# Altium schematic sheet 运输机器人3-1.SchDoc
size A2
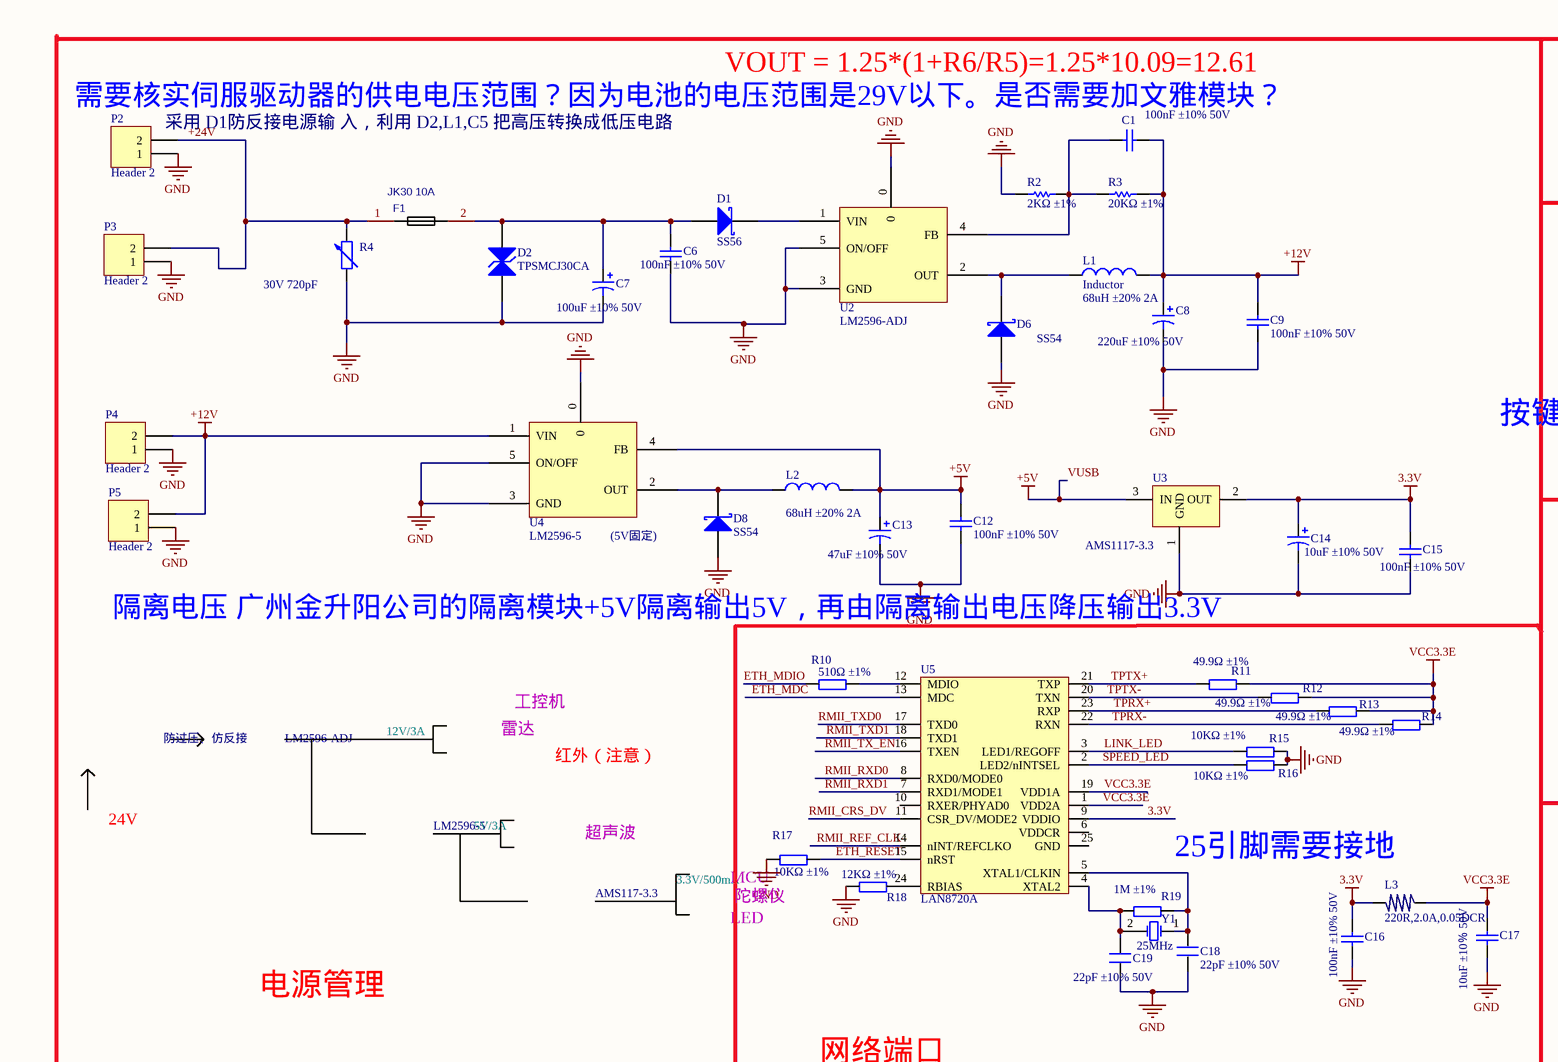
[diagram p0: 运输机器人3-1.SchDoc, top left]
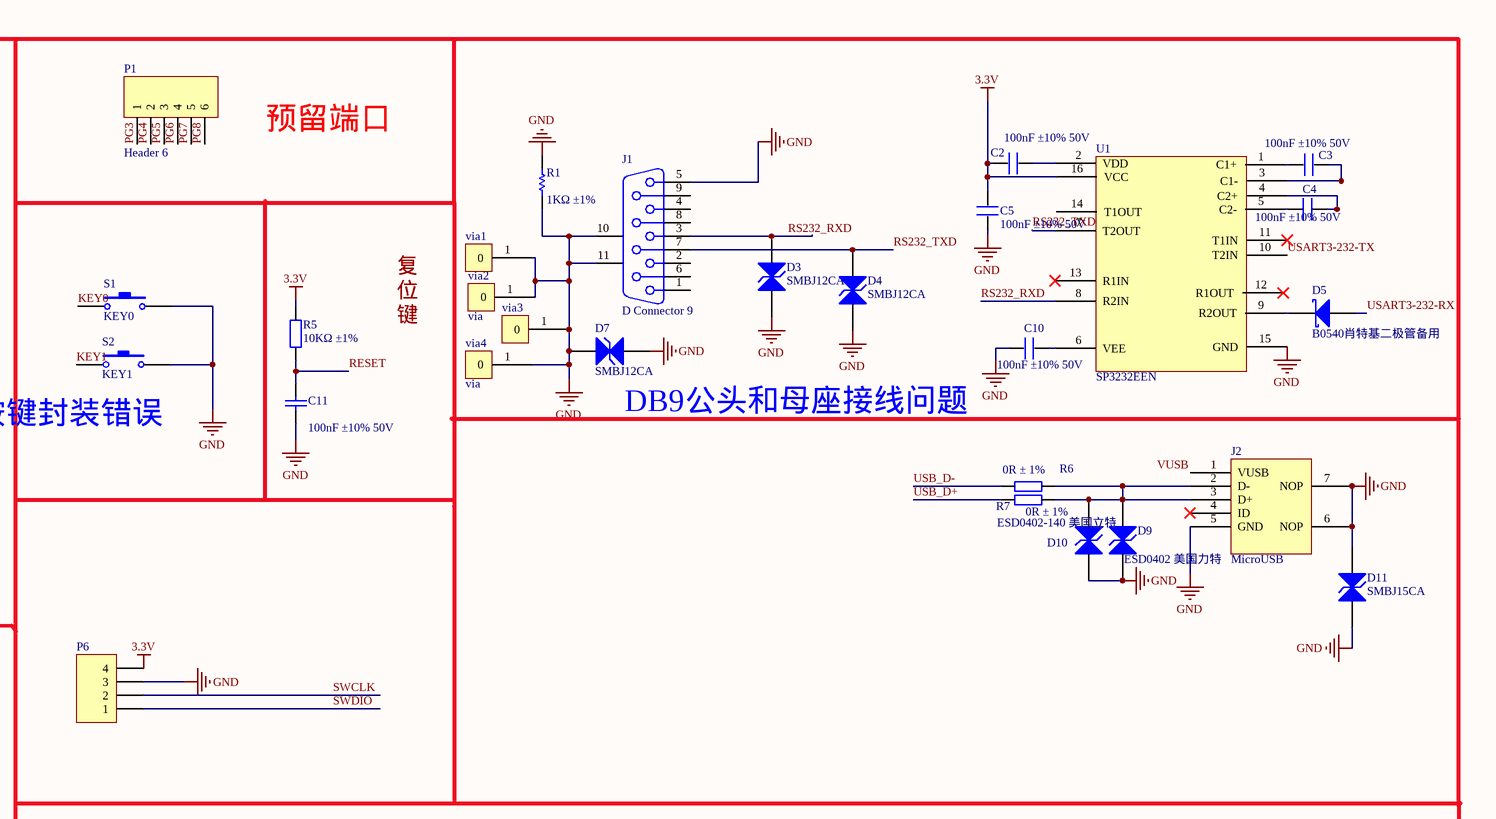
[diagram p1: 运输机器人3-1.SchDoc, top right]
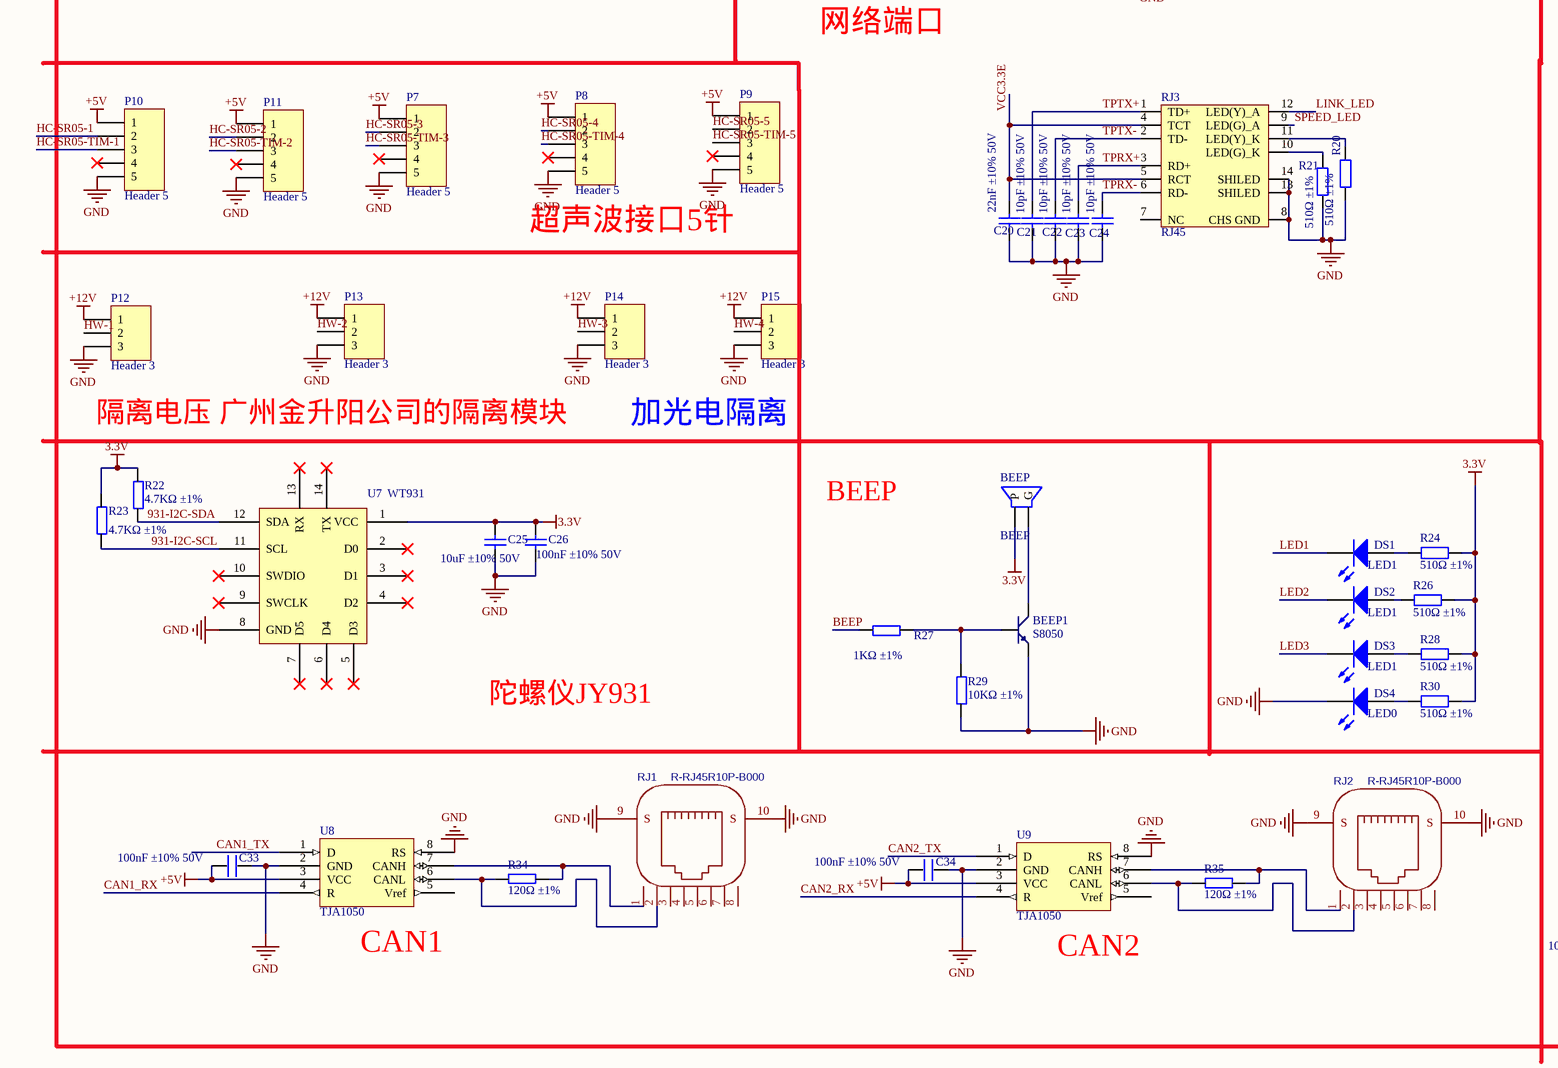
[diagram p2: 运输机器人3-1.SchDoc, bottom left]
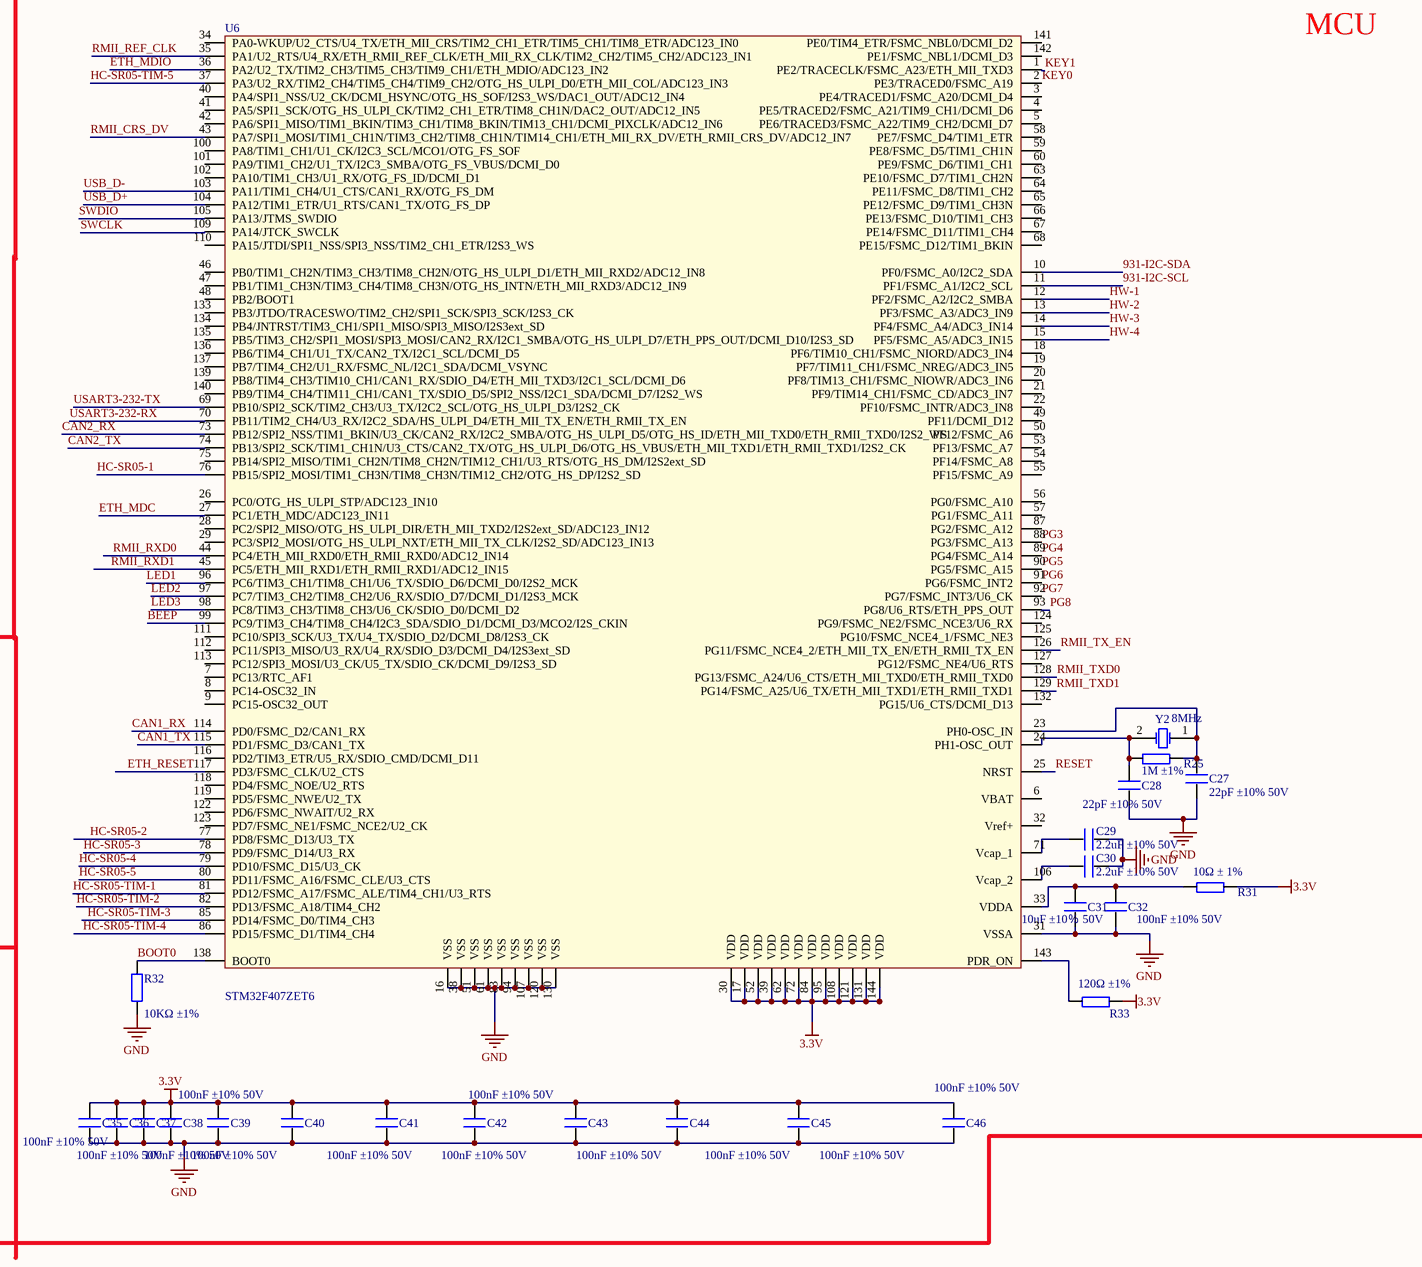
[diagram p3: 运输机器人3-1.SchDoc, bottom right]

## Parts
BEEP  BEEP  [LB-BUZ-TH_BD12.0-P7.60-D0.6-FD]
BEEP1  S8050  [LC-SOT-23(SOT-23-3)]
C1  100nF ±10% 50V  [LC-0603_C]
C2  100nF ±10% 50V  [LC-0603_C]
C3  100nF ±10% 50V  [LC-0603_C]
C4  100nF ±10% 50V  [LC-0603_C]
C5  100nF ±10% 50V  [LC-0603_C]
C6  100nF ±10% 50V  [LC-0603_C]
C7  100uF ±10% 50V  [C-RB.1/.4 8*12]
C8  220uF ±10% 50V  [C-RB.2/.4 Φ10]
C9  100nF ±10% 50V  [LC-0603_C]
C10  100nF ±10% 50V  [LC-0603_C]
C11  100nF ±10% 50V  [LC-0603_C]
C12  100nF ±10% 50V  [LC-0603_C]
C13  47uF ±10% 50V  [LC-1206_C]
C14  10uF ±10% 50V  [LC-1206_C]
C15  100nF ±10% 50V  [LC-0603_C]
C16  100nF ±10% 50V  [LC-0603_C]
C17  10uF ±10％ 50V  [LC-1206_C]
C18  22pF ±10% 50V  [LC-0603_C]
C19  22pF ±10% 50V  [LC-0603_C]
C20  22nF ±10% 50V  [LC-0603_C]
C21  10pF ±10% 50V  [LC-0603_C]
C22  10pF ±10% 50V  [LC-0603_C]
C23  10pF ±10% 50V  [LC-0603_C]
C24  10pF ±10% 50V  [LC-0603_C]
C25  10uF ±10% 50V  [LC-1206_C]
C26  100nF ±10% 50V  [LC-0603_C]
C27  22pF ±10% 50V  [LC-0603_C]
C28  22pF ±10% 50V  [LC-0603_C]
C29  2.2uF ±10% 50V  [LC-0603_C]
C30  2.2uF ±10% 50V  [LC-0603_C]
C31  10uF ±10％ 50V  [LC-1206_C]
C32  100nF ±10% 50V  [LC-0603_C]
C33  100nF ±10% 50V  [LC-0603_C]
C34  100nF ±10% 50V  [LC-0603_C]
C35  100nF ±10% 50V  [LC-0603_C]
C36  100nF ±10% 50V  [LC-0603_C]
C37  100nF ±10% 50V  [LC-0603_C]
C38  100nF ±10% 50V  [LC-0603_C]
C39  100nF ±10% 50V  [LC-0603_C]
C40  100nF ±10% 50V  [LC-0603_C]
C41  100nF ±10% 50V  [LC-0603_C]
C42  100nF ±10% 50V  [LC-0603_C]
C43  100nF ±10% 50V  [LC-0603_C]
C44  100nF ±10% 50V  [LC-0603_C]
C45  100nF ±10% 50V  [LC-0603_C]
C46  100nF ±10% 50V  [LC-0603_C]
D1  SS56  [LC-SMC(DO-214AB)_S2]
D2  TPSMCJ30CA  [LC-SMC(DO-214AB)_S4]
D3  SMBJ12CA  [LC-SMB(DO-214AA)_S4]
D4  SMBJ12CA  [LC-SMB(DO-214AA)_S4]
D5  B0540肖特基二极管备用  [LC-SOD-123]
D6  SS54  [LC-SMB(DO-214AA)_S4]
D7  SMBJ12CA  [LC-SMB(DO-214AA)_S4]
D8  SS54  [LC-SMB(DO-214AA)_S4]
D9  ESD0402 美国力特  [LC-0603]
D10  ESD0402-140 美国立特  [LC-0603]
D11  SMBJ15CA  [LC-SMB(DO-214AA)_S5]
DS1  LED1  [LC-0805]
DS2  LED1  [LC-0805]
DS3  LED1  [LC-0805]
DS4  LED0  [LC-0805]
F1  JK30 10A  [JK60-110]
J1  D Connector 9  [LB-DSUB-TH_DMR-9P]
J2  MicroUSB  [MicroUSB - 牛角无边]
L1  Inductor  value 68uH ±20% 2A  [SMDRH63]
L2  value 68uH ±20% 2A  [SMDRH63]  (hidden comment: Inductor)
L3  220R,2.0A,0.05DCR  [LC-0805_L]
P1  Header 6  [HDR1X6]
P2  Header 2  [LB-XT60PW]
P3  Header 2  [LB-XT60PW]
P4  Header 2  [LB-CONN-TH_2P-P5.08_WJ2EDGRC-5.08-2P]
P5  Header 2  [LB-CONN-TH_2P-P5.08_WJ2EDGRC-5.08-2P]
P6  Header 4  [HDR1X4]  (value not drawn)
P7  Header 5  [LB-CONN-TH_5P-P2.50_X8821WR-05S-N0SN]
P8  Header 5  [LB-CONN-TH_5P-P2.50_X8821WR-05S-N0SN]
P9  Header 5  [LB-CONN-TH_5P-P2.50_X8821WR-05S-N0SN]
P10  Header 5  [LB-CONN-TH_5P-P2.50_X8821WR-05S-N0SN]
P11  Header 5  [LB-CONN-TH_5P-P2.50_X8821WR-05S-N0SN]
P12  Header 3  [LB-CONN-TH_3P-P2.50_X8821WR-03S-N0SN]
P13  Header 3  [LB-CONN-TH_3P-P2.50_X8821WR-03S-N0SN]
P14  Header 3  [LB-CONN-TH_3P-P2.50_X8821WR-03S-N0SN]
P15  Header 3  [LB-CONN-TH_3P-P2.50_X8821WR-03S-N0SN]
R1  1KΩ ±1%  [LC-0603_R]
R2  2KΩ ±1%  [LC-0603_R]
R3  20KΩ ±1%  [LC-0603_R]
R4  30V 720pF  [R-7.5]
R5  10KΩ ±1%  [LC-0603_R]
R6  0R ± 1%  [LC-0603_R]
R7  0R ± 1%  [LC-0603_R]
R10  510Ω ±1%  [LC-0603_R]
R11  49.9Ω ±1%  [LC-0603_R]
R12  49.9Ω ±1%  [LC-0603_R]
R13  49.9Ω ±1%  [LC-0603_R]
R14  49.9Ω ±1%  [LC-0603_R]
R15  10KΩ ±1%  [LC-0603_R]
R16  10KΩ ±1%  [LC-0603_R]
R17  10KΩ ±1%  [LC-0603_R]
R18  12KΩ ±1%  [LC-0603_R]
R19  1M ±1%  [LC-0603_R]
R20  510Ω ±1%  [LC-0603_R]
R21  510Ω ±1%  [LC-0603_R]
R22  4.7KΩ ±1%  [LC-0603_R]
R23  4.7KΩ ±1%  [LC-0603_R]
R24  510Ω ±1%  [LC-0603_R]
R25  1M ±1%  [LC-0603_R]
R26  510Ω ±1%  [LC-0603_R]
R27  1KΩ ±1%  [LC-0603_R]
R28  510Ω ±1%  [LC-0603_R]
R29  10KΩ ±1%  [LC-0603_R]
R30  510Ω ±1%  [LC-0603_R]
R31  10Ω ± 1%  [LC-0603_R]
R32  10KΩ ±1%  [LC-0603_R]
R33  120Ω ±1%  [LC-0603_R]
R34  120Ω ±1%  [LC-0603_R]
R35  120Ω ±1%  [LC-0603_R]
RJ1  R-RJ45R10P-B000  [LB-RJ45-TH_R-RJ45R10P-B000]
RJ2  R-RJ45R10P-B000  [LB-RJ45-TH_R-RJ45R10P-B000]
RJ3  RJ45  [LB-HR911105A]
S1  KEY0  [LB-SW-TH_4P-L6.0-W6.0-P4.50-LS6.5]
S2  KEY1  [LB-SW-TH_4P-L6.0-W6.0-P4.50-LS6.5]
U1  SP3232EEN  [LC-SOIC-16_150mil]
U2  LM2596-ADJ  [LC-TO-263-5]
U3  AMS1117-3.3  [LC-SOT-223]
U4  LM2596-5  [LC-TO-263-5]
U5  LAN8720A  [LC-QFN-24_4x4x05P]
U6  STM32F407ZET6  [LC-LQFP-144_20x20x05P]
U7  WT931  [LB-WT931]
U8  TJA1050  [LC-SOIC-8_150mil]
U9  TJA1050  [LC-SOIC-8_150mil]
via1  via  [hole]  (value not drawn)
via2  via  [hole]
via3  via  [hole]  (value not drawn)
via4  via  [hole]
Y1  25MHz  [LC-HC-49S]
Y2  8MHz  [LC-HC-49S]

## Nets
3.3V: BEEP.1(P) C2.2 C5.1 C14.1 C15.1 C16.2 C25.2 C26.2 C35.2 C36.2 C37.2 C38.2 C39.2 C40.2 C41.2 C42.2 C43.2 C44.2 C45.2 C46.2 L3.2 P6.4 R5.2 R22.2 R23.2 R24.1 R26.1 R28.1 R30.1 R31.2 R33.2 U1.16(VCC) U3.2(OUT) U5.9(VDDIO) U6.17(VDD) U6.30(VDD) U6.39(VDD) U6.52(VDD) U6.62(VDD) U6.72(VDD) U6.84(VDD) U6.95(VDD) U6.108(VDD) U6.121(VDD) U6.131(VDD) U6.144(VDD) U7.1(VCC)
+12V: C1.2 C8.1 C9.2 L1.2 P4.2 P5.2 P12.1 P13.1 P14.1 P15.1 R3.2 U4.1(VIN)
GND: BEEP1.1(E) C5.2 C6.1 C7.2 C8.2 C9.1 C10.2 C11.1 C12.1 C13.2 C14.2 C15.2 C16.1 C17.1 C18.1 C19.1 C20.2 C21.2 C22.2 C23.2 C24.2 C25.1 C26.1 C27.1 C28.1 C29.2 C30.2 C31.1 C32.1 C33.2 C34.2 C35.1 C36.1 C37.1 C38.1 C39.1 C40.1 C41.1 C42.1 C43.1 C44.1 C45.1 C46.1 D2.1(A) D3.1(A) D4.1(A) D6.1(A) D7.1(A) D7.2(K) D8.1(A) D9.1(A) D10.1(A) D11.1(A) D11.2(K) DS4.2(K) J1.5 J1.10(MH1) J1.11(MH2) J2.5(GND) J2.6(NOP) J2.7(NOP) P2.1 P3.1 P4.1 P5.1 P6.3 P7.5 P8.5 P9.5 P10.5 P11.5 P12.3 P13.3 P14.3 P15.3 R1.1 R1.2 R2.1 R4.1 R15.2 R16.2 R17.1 R18.1 R20.2 R21.2 R29.1 R32.1 RJ1.9(S) RJ1.10(S) RJ2.9(S) RJ2.10(S) RJ3.8(CHS_GND) RJ3.13(SHILED) RJ3.14(SHILED) S1.2 S2.2 U1.15(GND) U2.0 U2.3(GND) U2.5(ON/OFF) U3.1(GND) U4.0 U4.3(GND) U4.5(ON/OFF) U6.16(VSS) U6.31(VSSA) U6.38(VSS) U6.51(VSS) U6.61(VSS) U6.83(VSS) U6.94(VSS) U6.107(VSS) U6.120(VSS) U6.130(VSS) U7.8(GND) U8.2(GND) U8.8(RS) U9.2(GND) U9.8(RS) via1.1(0) via2.1(0) via3.1(0) via4.1(0)
VCC3.3E: C17.2 C20.1 L3.1 R11.2 R12.2 R13.2 R14.2 RJ3.4(TCT) RJ3.5(RCT) U5.1(VDD2A) U5.19(VDD1A)
VUSB: C12.2 C13.1 C33.1 C34.1 J2.1(VUSB) L2.2 P7.1 P8.1 P9.1 P10.1 P11.1 U3.3(IN) U4.4(FB) U8.3(VCC) U9.3(VCC)  [also labelled +5V]
931-I2C-SCL: R23.1 U6.11(PF1/FSMC_A1/I2C2_SCL) U7.11(SCL)
931-I2C-SDA: R22.1 U6.10(PF0/FSMC_A0/I2C2_SDA) U7.12(SDA)
+24V: F1.1 P2.2 P3.2 R4.2
BEEP: R27.1 U6.99(PC9/TIM3_CH4/TIM8_CH4/I2C3_SDA/SDIO_D1/DCMI_D3/MCO2/I2S_CKIN)
BOOT0: R32.2 U6.138(BOOT0)
CAN1_RX: U6.114(PD0/FSMC_D2/CAN1_RX) U8.4(R)
CAN1_TX: U6.115(PD1/FSMC_D3/CAN1_TX) U8.1(D)
CAN2_RX: U6.73(PB12/SPI2_NSS/TIM1_BKIN/U3_CK/CAN2_RX/I2C2_SMBA/OTG_HS_ULPI_D5/OTG_HS_ID/ETH_MII_TXD0/ETH_RMII_TXD0/I2S2_WS) U9.4(R)
CAN2_TX: U6.74(PB13/SPI2_SCK/TIM1_CH1N/U3_CTS/CAN2_TX/OTG_HS_ULPI_D6/OTG_HS_VBUS/ETH_MII_TXD1/ETH_RMII_TXD1/I2S2_CK) U9.1(D)
ETH_MDC: U5.13(MDC) U6.27(PC1/ETH_MDC/ADC123_IN11)
ETH_MDIO: R10.1 U6.36(PA2/U2_TX/TIM2_CH3/TIM5_CH3/TIM9_CH1/ETH_MDIO/ADC123_IN2)
ETH_RESET: R17.2 U5.15(nRST) U6.117(PD3/FSMC_CLK/U2_CTS)
HC-SR05-1: P10.2 U6.76(PB15/SPI2_MOSI/TIM1_CH3N/TIM8_CH3N/TIM12_CH2/OTG_HS_DP/I2S2_SD)
HC-SR05-2: P11.2 U6.77(PD8/FSMC_D13/U3_TX)
HC-SR05-3: P7.2 U6.78(PD9/FSMC_D14/U3_RX)
HC-SR05-4: P8.2 U6.79(PD10/FSMC_D15/U3_CK)
HC-SR05-5: P9.2 U6.80(PD11/FSMC_A16/FSMC_CLE/U3_CTS)
HC-SR05-TIM-1: P10.3 U6.81(PD12/FSMC_A17/FSMC_ALE/TIM4_CH1/U3_RTS)
HC-SR05-TIM-2: P11.3 U6.82(PD13/FSMC_A18/TIM4_CH2)
HC-SR05-TIM-3: P7.3 U6.85(PD14/FSMC_D0/TIM4_CH3)
HC-SR05-TIM-4: P8.3 U6.86(PD15/FSMC_D1/TIM4_CH4)
HC-SR05-TIM-5: P9.3 U6.37(PA3/U2_RX/TIM2_CH4/TIM5_CH4/TIM9_CH2/OTG_HS_ULPI_D0/ETH_MII_COL/ADC123_IN3)
HW-1: P12.2 U6.12(PF2/FSMC_A2/I2C2_SMBA)
HW-2: P13.2 U6.13(PF3/FSMC_A3/ADC3_IN9)
HW-3: P14.2 U6.14(PF4/FSMC_A4/ADC3_IN14)
HW-4: P15.2 U6.15(PF5/FSMC_A5/ADC3_IN15)
KEY0: S1.1 U6.2(PE3/TRACED0/FSMC_A19)
KEY1: S2.1 U6.1(PE2/TRACECLK/FSMC_A23/ETH_MII_TXD3)
LED1: DS1.2(K) U6.96(PC6/TIM3_CH1/TIM8_CH1/U6_TX/SDIO_D6/DCMI_D0/I2S2_MCK)
LED2: DS2.2(K) U6.97(PC7/TIM3_CH2/TIM8_CH2/U6_RX/SDIO_D7/DCMI_D1/I2S3_MCK)
LED3: DS3.2(K) U6.98(PC8/TIM3_CH3/TIM8_CH3/U6_CK/SDIO_D0/DCMI_D2)
LINK_LED: R15.1 RJ3.12(LED(Y)_A) U5.3(LED1/REGOFF)
PG3: P1.1 U6.88(PG3/FSMC_A13)
PG4: P1.2 U6.89(PG4/FSMC_A14)
PG5: P1.3 U6.90(PG5/FSMC_A15)
PG6: P1.4 U6.91(PG6/FSMC_INT2)
PG7: P1.5 U6.92(PG7/FSMC_INT3/U6_CK)
PG8: P1.6 U6.93(PG8/U6_RTS/ETH_PPS_OUT)
RESET: C11.2 R5.1 U6.25(NRST)
RMII_CRS_DV: U5.11(CSR_DV/MODE2) U6.43(PA7/SPI1_MOSI/TIM1_CH1N/TIM3_CH2/TIM8_CH1N/TIM14_CH1/ETH_MII_RX_DV/ETH_RMII_CRS_DV/ADC12_IN7)
RMII_REF_CLK: U5.14(nINT/REFCLKO) U6.35(PA1/U2_RTS/U4_RX/ETH_RMII_REF_CLK/ETH_MII_RX_CLK/TIM2_CH2/TIM5_CH2/ADC123_IN1)
RMII_RXD0: U5.8(RXD0/MODE0) U6.44(PC4/ETH_MII_RXD0/ETH_RMII_RXD0/ADC12_IN14)
RMII_RXD1: U5.7(RXD1/MODE1) U6.45(PC5/ETH_MII_RXD1/ETH_RMII_RXD1/ADC12_IN15)
RMII_TX_EN: U5.16(TXEN) U6.126(PG11/FSMC_NCE4_2/ETH_MII_TX_EN/ETH_RMII_TX_EN)
RMII_TXD0: U5.17(TXD0) U6.128(PG13/FSMC_A24/U6_CTS/ETH_MII_TXD0/ETH_RMII_TXD0)
RMII_TXD1: U5.18(TXD1) U6.129(PG14/FSMC_A25/U6_TX/ETH_MII_TXD1/ETH_RMII_TXD1)
RS232_RXD: D3.2(K) J1.3 U1.8(R2IN)
RS232_TXD: D4.2(K) J1.7 U1.7(T2OUT)
SPEED_LED: R16.1 RJ3.9(LED(G)_A) U5.2(LED2/nINTSEL)
SWCLK: P6.2 U6.109(PA14/JTCK_SWCLK)
SWDIO: P6.1 U6.105(PA13/JTMS_SWDIO)
TPRX+: C23.1 R13.1 RJ3.3(RD+) U5.23(RXP)
TPRX-: C24.1 R14.1 RJ3.6(RD-) U5.22(RXN)
TPTX+: C21.1 R11.1 RJ3.1(TD+) U5.21(TXP)
TPTX-: C22.1 R12.1 RJ3.2(TD-) U5.20(TXN)
USART3-232-RX: D5.1(A) U6.70(PB11/TIM2_CH4/U3_RX/I2C2_SDA/HS_ULPI_D4/ETH_MII_TX_EN/ETH_RMII_TX_EN)
USART3-232-TX: U1.10(T2IN) U6.69(PB10/SPI2_SCK/TIM2_CH3/U3_TX/I2C2_SCL/OTG_HS_ULPI_D3/I2S2_CK)
USB_D+: R7.1 U6.104(PA12/TIM1_ETR/U1_RTS/CAN1_TX/OTG_FS_DP)
USB_D-: R6.1 U6.103(PA11/TIM1_CH4/U1_CTS/CAN1_RX/OTG_FS_DM)
NetBEEP1_2: BEEP1.2(B) R27.2 R29.2
NetBEEP_2: BEEP.2(G) BEEP1.3(C)
NetC1_1: C1.1 R2.2 R3.1 U2.4(FB)
NetC2_1: C2.1 U1.2(VDD)
NetC3_1: C3.1 U1.3(C1-)
NetC3_2: C3.2 U1.1(C1+)
NetC4_1: C4.1 U1.4(C2+)
NetC4_2: C4.2 U1.5(C2-)
NetC6_2: C6.2 C7.1 D1.1(A) D2.2(K) F1.2
NetC10_1: C10.1 U1.6(VEE)
NetC18_2: C18.2 R19.2 U5.5(XTAL1/CLKIN) Y1.1(OSC1)
NetC19_2: C19.2 R19.1 U5.4(XTAL2) Y1.2(OSC2)
NetC27_2: C27.2 R25.2 U6.23(PH0-OSC_IN) Y2.1(OSC1)
NetC28_2: C28.2 R25.1 U6.24(PH1-OSC_OUT) Y2.2(OSC2)
NetC29_1: C29.1 U6.71(Vcap_1)
NetC30_1: C30.1 U6.106(Vcap_2)
NetC31_2: C31.2 C32.2 R31.1 U6.33(VDDA)
NetD1_2: D1.2(K) U2.1(VIN)
NetD5_2: D5.2(K) U1.9(R2OUT)
NetD6_2: D6.2(K) L1.1 U2.2(OUT)
NetD8_2: D8.2(K) L2.1 U4.2(OUT)
NetD9_2: D9.2(K) D10.2(K) J2.2(D-) J2.3(D+) R6.2 R7.2
NetDS1_1: DS1.1(A) R24.2
NetDS2_1: DS2.1(A) R26.2
NetDS3_1: DS3.1(A) R28.2
NetDS4_1: DS4.1(A) R30.2
NetR10_2: R10.2 U5.12(MDIO)
NetR18_2: R18.2 U5.24(RBIAS)
NetR20_1: R20.1 RJ3.11(LED(Y)_K)
NetR21_1: R21.1 RJ3.10(LED(G)_K)
NetR33_1: R33.1 U6.143(PDR_ON)
NetR34_1: R34.1 RJ1.1 U8.7(CANH)
NetR34_2: R34.2 RJ1.2 U8.6(CANL)
NetR35_1: R35.1 RJ2.1 U9.7(CANH)
NetR35_2: R35.2 RJ2.2 U9.6(CANL)

Not connected (* = marked no-connect by the designer): J1 1 2 4 6 8 9; J2 4(ID)*; P7 4*; P8 4*; P9 4*; P10 4*; P11 4*; RJ1 3 4 5 6 7 8; RJ2 3 4 5 6 7 8; RJ3 7(NC); U1 11(T1IN)* 12(R1OUT)* 13(R1IN)* 14(T1OUT); U5 6(VDDCR) 10(RXER/PHYAD0) 25(GND); U6 3(PE4/TRACED1/FSMC_A20/DCMI_D4) 4(PE5/TRACED2/FSMC_A21/TIM9_CH1/DCMI_D6) 5(PE6/TRACED3/FSMC_A22/TIM9_CH2/DCMI_D7) 6(VBAT) 7(PC13/RTC_AF1) 8(PC14-OSC32_IN) 9(PC15-OSC32_OUT) 18(PF6/TIM10_CH1/FSMC_NIORD/ADC3_IN4) 19(PF7/TIM11_CH1/FSMC_NREG/ADC3_IN5) 20(PF8/TIM13_CH1/FSMC_NIOWR/ADC3_IN6) 21(PF9/TIM14_CH1/FSMC_CD/ADC3_IN7) 22(PF10/FSMC_INTR/ADC3_IN8) 26(PC0/OTG_HS_ULPI_STP/ADC123_IN10) 28(PC2/SPI2_MISO/OTG_HS_ULPI_DIR/ETH_MII_TXD2/I2S2ext_SD/ADC123_IN12) 29(PC3/SPI2_MOSI/OTG_HS_ULPI_NXT/ETH_MII_TX_CLK/I2S2_SD/ADC123_IN13) 32(Vref+) 34(PA0-WKUP/U2_CTS/U4_TX/ETH_MII_CRS/TIM2_CH1_ETR/TIM5_CH1/TIM8_ETR/ADC123_IN0) 40(PA4/SPI1_NSS/U2_CK/DCMI_HSYNC/OTG_HS_SOF/I2S3_WS/DAC1_OUT/ADC12_IN4) 41(PA5/SPI1_SCK/OTG_HS_ULPI_CK/TIM2_CH1_ETR/TIM8_CH1N/DAC2_OUT/ADC12_IN5) 42(PA6/SPI1_MISO/TIM1_BKIN/TIM3_CH1/TIM8_BKIN/TIM13_CH1/DCMI_PIXCLK/ADC12_IN6) 46(PB0/TIM1_CH2N/TIM3_CH3/TIM8_CH2N/OTG_HS_ULPI_D1/ETH_MII_RXD2/ADC12_IN8) 47(PB1/TIM1_CH3N/TIM3_CH4/TIM8_CH3N/OTG_HS_INTN/ETH_MII_RXD3/ADC12_IN9) 48(PB2/BOOT1) 49(PF11/DCMI_D12) 50(PF12/FSMC_A6) 53(PF13/FSMC_A7) 54(PF14/FSMC_A8) 55(PF15/FSMC_A9) 56(PG0/FSMC_A10) 57(PG1/FSMC_A11) 58(PE7/FSMC_D4/TIM1_ETR) 59(PE8/FSMC_D5/TIM1_CH1N) 60(PE9/FSMC_D6/TIM1_CH1) 63(PE10/FSMC_D7/TIM1_CH2N) 64(PE11/FSMC_D8/TIM1_CH2) 65(PE12/FSMC_D9/TIM1_CH3N) 66(PE13/FSMC_D10/TIM1_CH3) 67(PE14/FSMC_D11/TIM1_CH4) 68(PE15/FSMC_D12/TIM1_BKIN) 75(PB14/SPI2_MISO/TIM1_CH2N/TIM8_CH2N/TIM12_CH1/U3_RTS/OTG_HS_DM/I2S2ext_SD) 87(PG2/FSMC_A12) 100(PA8/TIM1_CH1/U1_CK/I2C3_SCL/MCO1/OTG_FS_SOF) 101(PA9/TIM1_CH2/U1_TX/I2C3_SMBA/OTG_FS_VBUS/DCMI_D0) 102(PA10/TIM1_CH3/U1_RX/OTG_FS_ID/DCMI_D1) 110(PA15/JTDI/SPI1_NSS/SPI3_NSS/TIM2_CH1_ETR/I2S3_WS) 111(PC10/SPI3_SCK/U3_TX/U4_TX/SDIO_D2/DCMI_D8/I2S3_CK) 112(PC11/SPI3_MISO/U3_RX/U4_RX/SDIO_D3/DCMI_D4/I2S3ext_SD) 113(PC12/SPI3_MOSI/U3_CK/U5_TX/SDIO_CK/DCMI_D9/I2S3_SD) 116(PD2/TIM3_ETR/U5_RX/SDIO_CMD/DCMI_D11) 118(PD4/FSMC_NOE/U2_RTS) 119(PD5/FSMC_NWE/U2_TX) 122(PD6/FSMC_NWAIT/U2_RX) 123(PD7/FSMC_NE1/FSMC_NCE2/U2_CK) 124(PG9/FSMC_NE2/FSMC_NCE3/U6_RX) 125(PG10/FSMC_NCE4_1/FSMC_NE3) 127(PG12/FSMC_NE4/U6_RTS) 132(PG15/U6_CTS/DCMI_D13) 133(PB3/JTDO/TRACESWO/TIM2_CH2/SPI1_SCK/SPI3_SCK/I2S3_CK) 134(PB4/JNTRST/TIM3_CH1/SPI1_MISO/SPI3_MISO/I2S3ext_SD) 135(PB5/TIM3_CH2/SPI1_MOSI/SPI3_MOSI/CAN2_RX/I2C1_SMBA/OTG_HS_ULPI_D7/ETH_PPS_OUT/DCMI_D10/I2S3_SD) 136(PB6/TIM4_CH1/U1_TX/CAN2_TX/I2C1_SCL/DCMI_D5) 137(PB7/TIM4_CH2/U1_RX/FSMC_NL/I2C1_SDA/DCMI_VSYNC) 139(PB8/TIM4_CH3/TIM10_CH1/CAN1_RX/SDIO_D4/ETH_MII_TXD3/I2C1_SCL/DCMI_D6) 140(PB9/TIM4_CH4/TIM11_CH1/CAN1_TX/SDIO_D5/SPI2_NSS/I2C1_SDA/DCMI_D7/I2S2_WS) 141(PE0/TIM4_ETR/FSMC_NBL0/DCMI_D2) 142(PE1/FSMC_NBL1/DCMI_D3); U7 2(D0)* 3(D1)* 4(D2)* 5(D3)* 6(D4)* 7(D5)* 9(SWCLK)* 10(SWDIO)* 13(RX)* 14(TX)*; U8 5(Vref); U9 5(Vref)

## Notes on the sheet
- (near P2) 需要核实伺服驱动器的供电电压范围？因为电池的电压范围是29V以下。是否需要加文雅模块？
- VOUT = 1.25*(1+R6/R5)=1.25*10.09=12.61
- (near P2) 采用 D1防反接电源输 入，利用 D2,L1,C5 把高压转换成低压电路
- 预留端口
- (near S2) 按键封装错误
- 复位键
- (near D7) DB9公头和母座接线问题
- (near U4) (5V固定)
- 隔离电压 广州金升阳公司的隔离模块+5V隔离输出5V，再由隔离输出电压降压输出3.3V
- 工控机
- 防过压、仿反接
- LM2596-ADJ
- 12V/3A
- 雷达
- 红外（注意）
- 24V
- LM2596-5
- 5V/3A
- 超声波
- 25引脚需要接地
- AMS117-3.3
- 3.3V/500mA
- (near R17) MCU
- LED
- (near R17) 陀螺仪
- MCU
- 电源管理
- 网络端口
- (near P8) 超声波接口5针
- 隔离电压 广州金升阳公司的隔离模块
- 加光电隔离
- BEEP
- 陀螺仪JY931
- (near U8) CAN1
- (near U9) CAN2

## Library data of the parts
BEEP1 = NPN: 8050/BCW846/BCW847
C1 C6 C12 C15-C17 C20-C26 = Cap: Capacitor; Published: 8-Jun-2000; LatestRevisionDate: 17-Jul-2002; LatestRevisionNote: Re-released for DXP Platform.; PackageReference: RAD-0.3; Publisher: Altium Limited; PackageDescription: Radial Cap, Thru-Hole; 2 Leads; 0.3 in Pin Spacing
  C1 C6 C12 C15 C16 C26: Value: 100nF ±10% 50V
  C17: Value: 10uF ±10％ 50V
  C20: Value: 22nF ±10% 50V
  C21-C24: Value: 10pF ±10% 50V
  C25: Value: 10uF ±10% 50V
C2-C5 C10 C18 C19 C27-C46 = C
C7 C13 C14 = Cap Pol1: Polarized Capacitor (Radial); Published: 8-Jun-2000; LatestRevisionDate: 17-Jul-2002; LatestRevisionNote: Re-released for DXP Platform.; PackageReference: RB7.6-15; Publisher: Altium Limited; PackageDescription: Polarized Capacitor (Radial); 2 Leads
  C7: Value: 100uF ±10% 50V
  C13: Value: 47uF ±10% 50V
  C14: Value: 10uF ±10% 50V
C8 = Cap Pol1: Polarized Capacitor (Radial); Value: 220uF ±20% 50V; Published: 8-Jun-2000; LatestRevisionDate: 17-Jul-2002; LatestRevisionNote: Re-released for DXP Platform.; PackageReference: RB7.6-15; Publisher: Altium Limited; PackageDescription: Polarized Capacitor (Radial); 2 Leads
C9 = Cap: Capacitor; Value: 100nF ±10％ 50V; Published: 8-Jun-2000; LatestRevisionDate: 17-Jul-2002; LatestRevisionNote: Re-released for DXP Platform.; PackageReference: RAD-0.3; Publisher: Altium Limited; PackageDescription: Radial Cap, Thru-Hole; 2 Leads; 0.3 in Pin Spacing
C11 = Cap Semi: Capacitor (Semiconductor SIM Model); Published: 8-Jun-2000; LatestRevisionDate: 29-May-2009; LatestRevisionNote: IPC-7351 Footprint Added.; PackageReference: C1206; Publisher: Altium Limited; PackageDescription: Chip Capacitor; Value: 100nF ±10% 50V
D1 D5 D6 D8 = D Schottky: Schottky Diode; Published: 8-Jun-2000; LatestRevisionDate: 17-Jul-2002; LatestRevisionNote: Re-released for DXP Platform.; PackageReference: SMB; Publisher: Altium Limited; PackageDescription: DO-214-AA/SMB; 2 C-Bend Leads; Body 5.3 x 3.6 mm, inc. leads (LxW); Code_JEDEC: DO-214-AA
D2-D4 D7 D9-D11 = D Zener: Zener Diode; Published: 8-Jun-2000; LatestRevisionDate: 17-Jul-2002; LatestRevisionNote: Re-released for DXP Platform.; PackageReference: DIODE-0.7; Publisher: Altium Limited; PackageDescription: Diode, Thru-Hole; 2 Leads; 0.7 in Pin Spacing
DS1-DS4 = LED2: Typical RED, GREEN, YELLOW, AMBER GaAs LED; Published: 8-Jun-2000; LatestRevisionDate: 17-Jul-2002; LatestRevisionNote: Re-released for DXP Platform.; PackageDocument: Feb-2002; PackageReference: 3.2X1.6X1.1; Publisher: Altium Limited
F1 = Self-healing fuse/HRL30-500: BOM_Manufacturer: RUILON; BOM_Supplier: LCSC; BOM_Manufacturer Part: Self-healing fuse/HRL30-500; image: //image.lceda.cn/szlcsc/C14155.jpg; BOM_Supplier Part: C14155; spicePre: F; spiceSymbolName: Self-healing fuse/HRL30-500
J1 = D Connector 9: Receptacle Assembly, 9 Position, Right Angle; PackageDocument: O; Positions: 9; Published: 15-Jun-2001; LatestRevisionDate: 17-Jul-2002; LatestRevisionNote: Re-released for DXP Platform.; DatasheetDocument: 1-Sep-1999; PackageReference: 788750; Publisher: Altium Limited; Orientation: Right Angle; Gender: Receptacle
L1 L2 = Inductor: Code_IEC: 1005; Published: 8-Jun-2000; LatestRevisionDate: 29-May-2009; LatestRevisionNote: IPC-7351 Footprint Added.; PackageReference: 0402-A; Publisher: Altium Limited; PackageDescription: Chip Inductor; Code_JEITA: 0402
L3 = L
P1 = Header 6: Header, 6-Pin; LatestRevisionDate: 17-Jul-2002; LatestRevisionNote: Re-released for DXP Platform.; Publisher: Altium Limited
P2-P5 = Header 2: Header, 2-Pin; LatestRevisionDate: 17-Jul-2002; LatestRevisionNote: Re-released for DXP Platform.; Publisher: Altium Limited
P6 = Header 4: Header, 4-Pin; LatestRevisionDate: 17-Jul-2002; LatestRevisionNote: Re-released for DXP Platform.; Publisher: Altium Limited
P7-P11 = Header 5: Header, 5-Pin; LatestRevisionDate: 17-Jul-2002; LatestRevisionNote: Re-released for DXP Platform.; Publisher: Altium Limited
P12-P15 = Header 3: Header, 3-Pin; LatestRevisionDate: 17-Jul-2002; LatestRevisionNote: Re-released for DXP Platform.; Publisher: Altium Limited
R1-R3 = Res1: Resistor; Published: 8-Jun-2000; LatestRevisionDate: 17-Jul-2002; LatestRevisionNote: Re-released for DXP Platform.; PackageReference: AXIAL-0.3; Publisher: Altium Limited; PackageDescription: Axial Device, Thru-Hole; 2 Leads; 0.3 in Pin Spacing
  R1: Value: 1KΩ ±1%
  R2: Value: 2KΩ ±1%
  R3: Value: 20KΩ ±1%
R4 = Res Adj2: Variable Resistor; Set Position: 0.5; Published: 8-Jun-2000; LatestRevisionDate: 17-Jul-2002; LatestRevisionNote: Re-released for DXP Platform.; PackageReference: AXIAL-0.6; Publisher: Altium Limited; PackageDescription: Axial Device, Thru-Hole; 2 Leads; 0.6 in Pin Spacing; Value: 30V 720pF
R5 R20 R21 R24 R26 R28 R30 R32 = R: 贴片电阻; 版权归属: 源创客; BOM名称: 贴片电阻; 学习资源: www.ooocke.com
R6 R7 R10-R19 R22 R23 R25 R27 R29 R31 R33-R35 = R
RJ1 RJ2 = R-RJ45R10P-B000: BOM_Manufacturer: Shenzhen Cankemeng; Contributor: LCSC; BOM_Supplier: LCSC; BOM_Supplier Part: C386758; BOM_Manufacturer Part: R-RJ45R10P-B000; spicePre: R; spiceSymbolName: R-RJ45R10P-B000
RJ3 = HR911105
S1 S2 = SW-PB: Switch; Published: 24-Mar-1999; LatestRevisionDate: 17-Jul-2002; LatestRevisionNote: Re-released for DXP Platform.; PackageReference: SPST-2; Publisher: Altium Limited; PackageDescription: Switch; 2 Leads
U3 = LM1084
U4 = LM2596-ADJ
U5 = LAN8720: ETH PHY
U8 U9 = SN65HVD230D
Y1 Y2 = XTAL: Crystal Oscillator; Published: 8-Jun-2000; LatestRevisionDate: 17-Jul-2002; LatestRevisionNote: Re-released for DXP Platform.; Publisher: Altium Limited